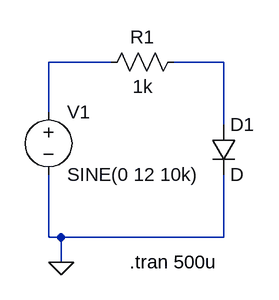
[diagram p0: schematic halfWaveRectifier2.asc]
halfWaveRectifier2.asc, the LTspice schematic file:
Version 4
SHEET 1 880 680
WIRE -16 64 -96 64
WIRE 128 64 64 64
WIRE -96 128 -96 64
WIRE 128 144 128 64
WIRE -96 288 -96 208
WIRE -80 288 -96 288
WIRE 128 288 128 208
WIRE 128 288 -80 288
WIRE -80 320 -80 288
FLAG -80 320 0
SYMBOL voltage -96 112 R0
WINDOW 123 0 0 Left 0
WINDOW 39 0 0 Left 0
SYMATTR InstName V1
SYMATTR Value SINE(0 12 10k)
SYMBOL diode 112 144 R0
SYMATTR InstName D1
SYMBOL res 80 48 R90
WINDOW 0 0 56 VBottom 2
WINDOW 3 32 56 VTop 2
SYMATTR InstName R1
SYMATTR Value 1k
TEXT 8 320 Left 2 !.tran 500u

The netlist it stands for:
* halfWaveRectifier2.asc
V1 N001 0 SINE(0 12 10k)
D1 N002 0 D
R1 N002 N001 1k
.model D D
.lib standard.dio
.tran 500u
.backanno
.end